# Altium schematic sheet 43-OVER VOLTAGE PROTECTION CKT.SchDoc
size 513 x 386 mm
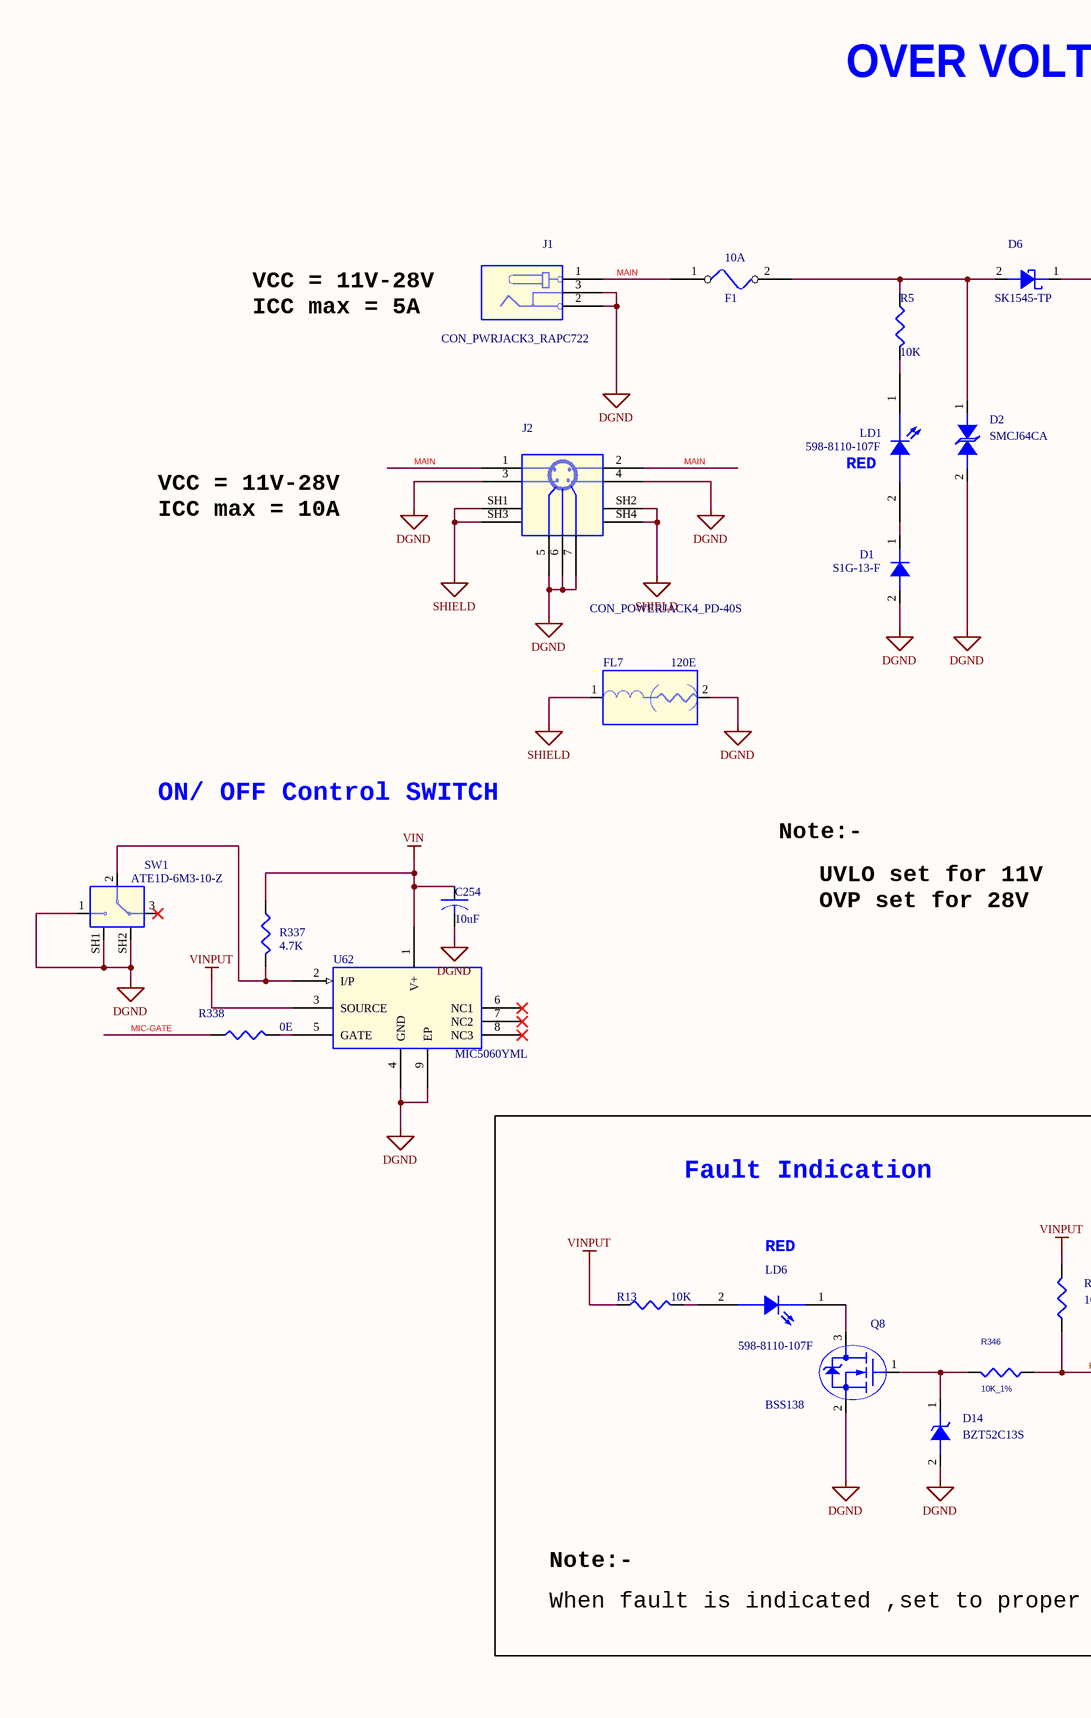
[diagram p0: 43-OVER VOLTAGE PROTECTION CKT.SchDoc, left]
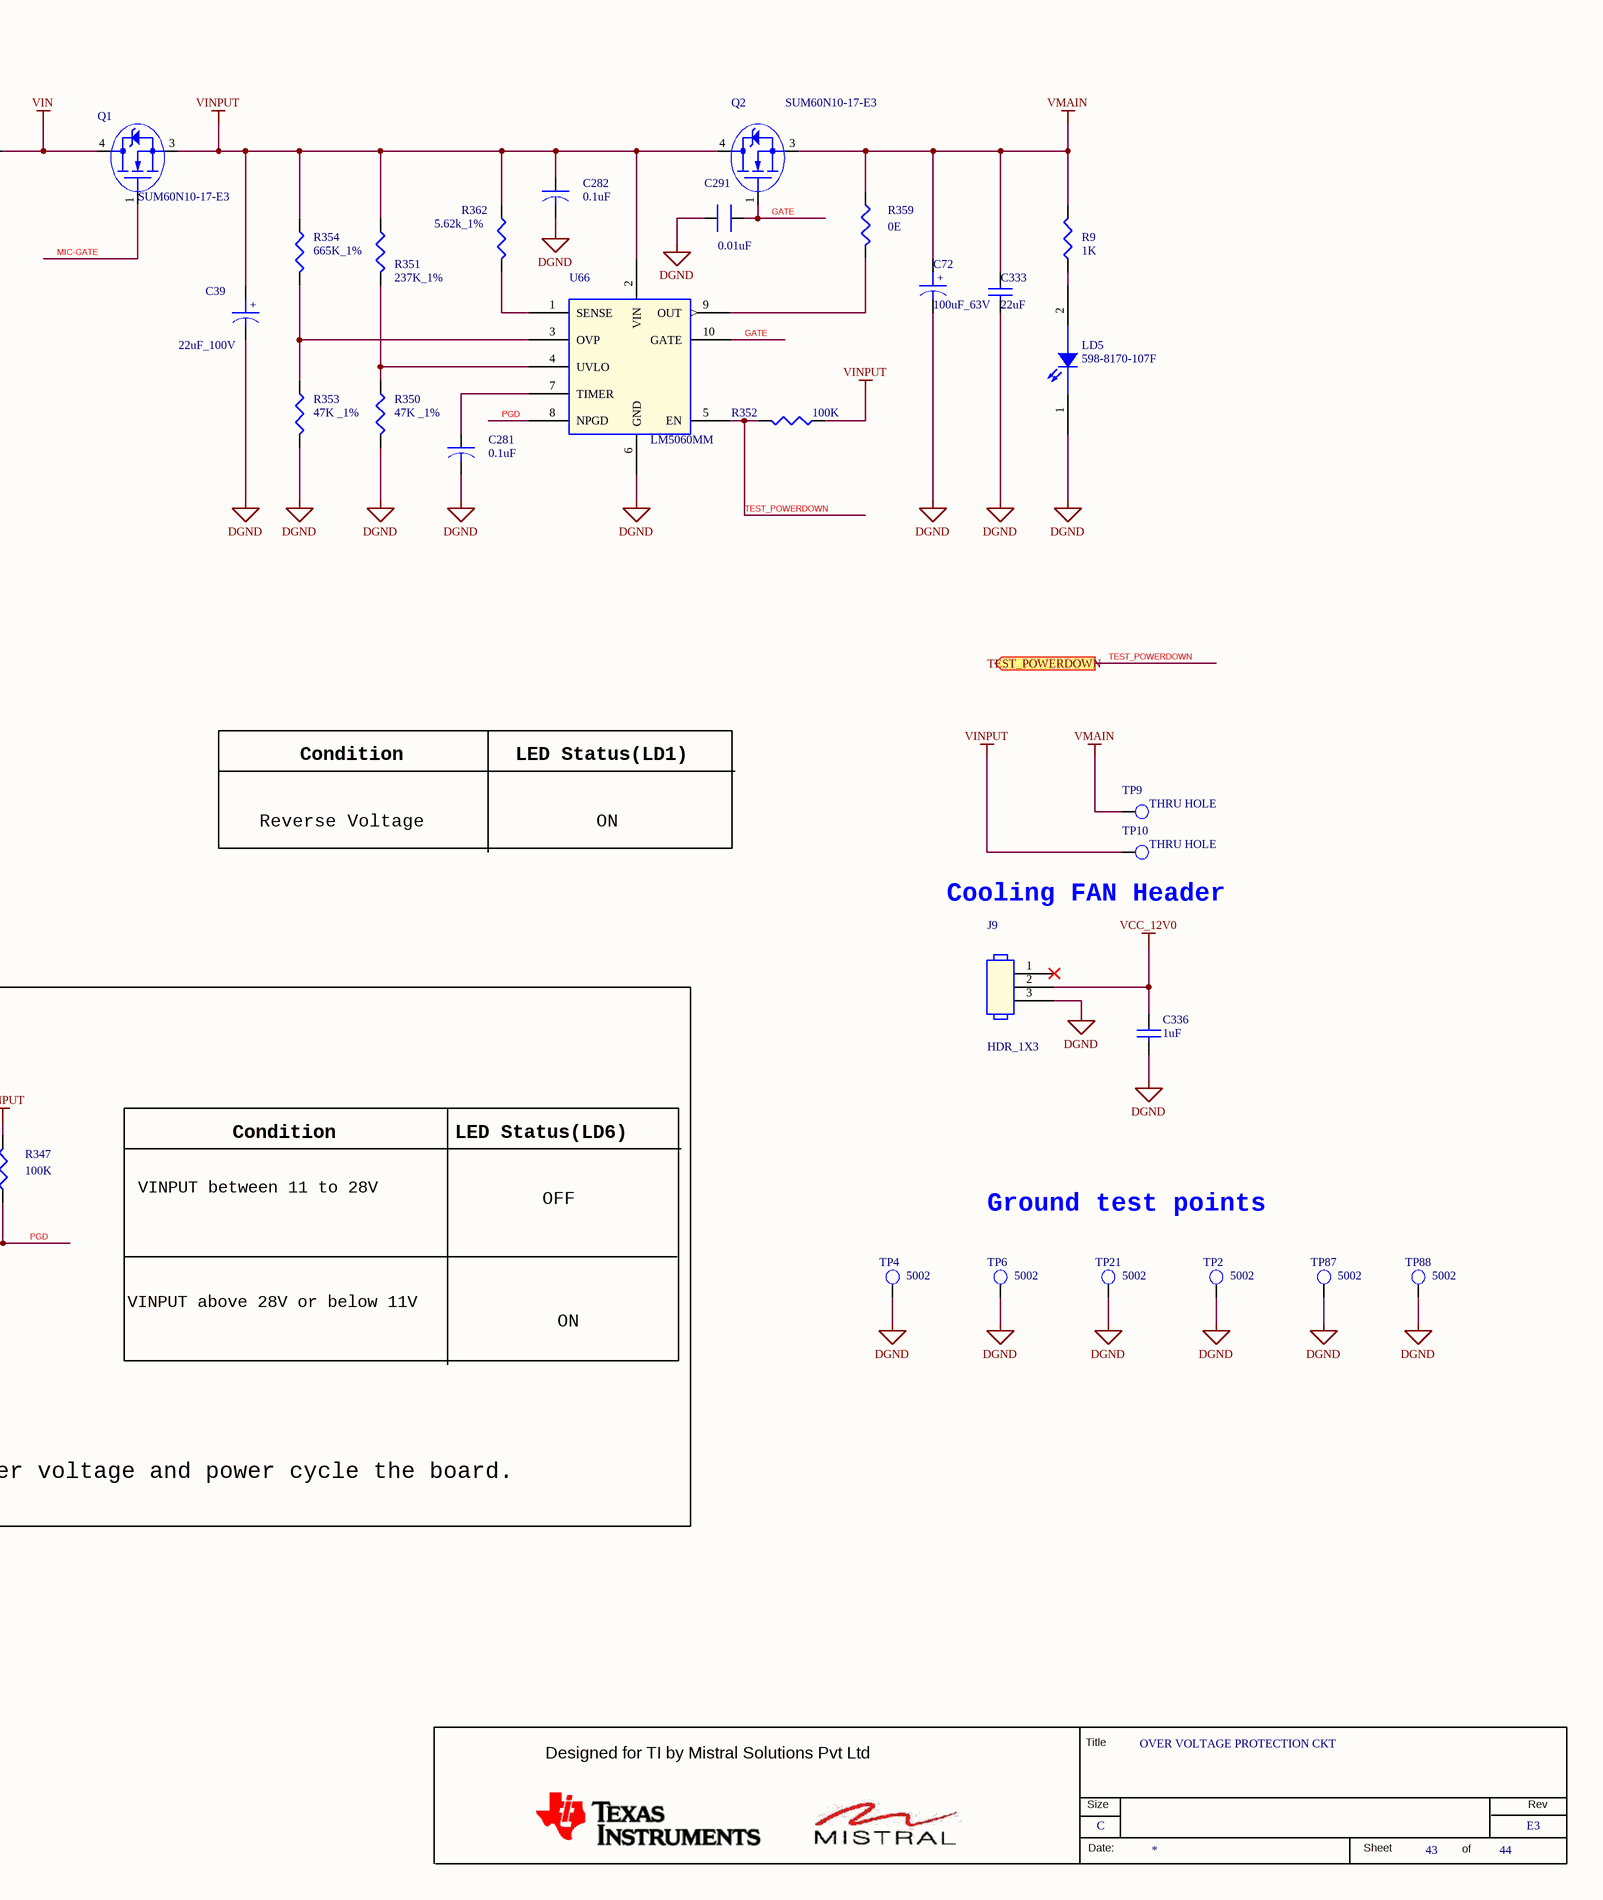
[diagram p1: 43-OVER VOLTAGE PROTECTION CKT.SchDoc, right]

## Parts
*  RevCode: E3  Title: OVER VOLTAGE PROTECTION CKT  Page Size: C  Page Number: 43  Page Count: 44  (hidden comment: MISTRAL_TITLEBLK_CSIZE)  (graphical)
C39  22uF_100V  [CAPAE_GCASE]
C72  100uF_63V  [CAPAE_CASE103103_11]
C254  10uF  [CAP1206_2]
C281  0.1uF  [CAP0603_1]
C282  0.1uF  [CAP0603_1]
C291  0.01uF  [CAP0201_0-5]
C333  22uF  [CAP7563_4]
C336  1uF  [CAP0603_1]
D1  S1G-13-F  [DIO_SMA]
D2  SMCJ64CA  [DIO_SMC]
D6  SK1545-TP  [DO-214AB_5-6]
D14  BZT52C13S  [DIO_SOD323]
F1  10A  [FUSE_397_410X110_SMD_2-9]
FL7  120E  [EMIFIL_BLM15A_0402_0-6]
J1  CON_PWRJACK3_RAPC722  [CON_PWRJACK3_RAPC722_P_R_T]
J2  CON_POWERJACK4_PD-40S  [CON_POWERJACK4_PD-40S_S_R_T_15]
J9  HDR_1X3  [HDR_1X3_440054-3_S_T_6-4]
LD1  598-8110-107F  [LED_0805]
LD5  598-8170-107F  [LED_0805_0-7]
LD6  598-8110-107F  [LED_0805]
Q1  SUM60N10-17-E3  [D2PAK-3]
Q2  SUM60N10-17-E3  [D2PAK-3]
Q8  BSS138  [TO_SOT23-123]
R5  10K  [RES1206]
R9  1K  [RES0201]
R13  10K  [RES1206]
R337  4.7K  [RES0402]
R338  0E  [RES0402_0-5]
R346  10K_1%  [RES0402_0-5]
R347  100K  [RES0402_0-5]
R350  47K _1%  [RES0402_0-5]
R351  237K_1%  [RES0402]
R352  100K  [RES0402_0-5]
R353  47K _1%  [RES0402_0-5]
R354  665K_1%  [RES0603_0-5]
R359  0E  [RES0402_0-5]
R362  5.62k_1%  [RES0603]
SW1  ATE1D-6M3-10-Z  [SW3_ATE1F-6M3_370X710_TH_5-6]
TP2  5002  [TP_CIR67D40_TH_4-6]
TP4  5002  [TP_CIR67D40_TH_4-6]
TP6  5002  [TP_CIR67D40_TH_4-6]
TP9  THRU HOLE  [TP_40X65]
TP10  THRU HOLE  [TP_40X65]
TP21  5002  [TP_CIR67D40_TH_4-6]
TP87  5002  [TP_CIR67D40_TH_4-6]
TP88  5002  [TP_CIR67D40_TH_4-6]
U62  MIC5060YML  [DFN8_25-59_120X120_1]
U66  LM5060MM  [MSOP10_19-68_120X120]

## Blocks framed on the sheet
Fault Indication: D14 LD6 Q8 R13 R346 R347

## Ports
TEST_POWERDOWN (out)

## Nets
DGND: C39.2 C72.2 C254.2 C281.2 C282.2 C291.2 C333.2 C336.2 D1.2(A) D2.2(ANODE) D14.2(ANODE) FL7.2 J1.2 J1.3 J2.3 J2.4 J2.5 J2.6 J2.7 J9.3 LD5.1 Q8.2(S) R350.2 R353.2 SW1.1 SW1.SH1 SW1.SH2 TP2.1(TP) TP4.1(TP) TP6.1(TP) TP21.1(TP) TP87.1(TP) TP88.1(TP) U62.4(GND) U62.9(EP) U66.6(GND)
SHIELD: FL7.1 J2.SH1 J2.SH2 J2.SH3 J2.SH4
VCC_12V0: C336.1 J9.2
VIN: C254.1 D6.1(CATHODE) Q1.4(D) R337.1 U62.1(V+)
VINPUT: C39.1 C282.1 Q1.3(S) Q2.4(D) R13.1 R347.2 R351.1 R352.1 R354.1 R362.1 TP10.1(TP) U62.3(SOURCE) U66.2(VIN)
VMAIN: C72.1 C333.1 Q2.3(S) R9.1 R359.1 TP9.1(TP)
GATE: C291.1 Q2.1(G) U66.10(GATE)
MAIN: F1.1 J1.1 J2.1 J2.2
MIC-GATE: Q1.1(G) R338.1
PGD: R346.1 R347.1 U66.8(NPGD)
TEST_POWERDOWN: R352.2 U66.5(EN) ; port TEST_POWERDOWN
NetC281_1: C281.1 U66.7(TIMER)
NetD1_1: D1.1(K) LD1.2
NetD2_1: D2.1(CATHODE) D6.2(ANODE) F1.2 R5.1
NetD14_1: D14.1(CATHODE) Q8.1(G) R346.2
NetLD1_1: LD1.1 R5.2
NetLD5_2: LD5.2 R9.2
NetLD6_1: LD6.1 Q8.3(D)
NetLD6_2: LD6.2 R13.2
NetR337_2: R337.2 SW1.2 U62.2(I/P)
NetR338_2: R338.2 U62.5(GATE)
NetR350_1: R350.1 R351.2 U66.4(UVLO)
NetR353_1: R353.1 R354.2 U66.3(OVP)
NetR359_2: R359.2 U66.9(OUT)
NetR362_2: R362.2 U66.1(SENSE)

Not connected (* = marked no-connect by the designer): J9 1*; SW1 3*; U62 6(NC1)* 7(NC2)* 8(NC3)*

## Notes on the sheet
- OVER VOLTAGE PROTECTION CIRCUIT
- VCC = 11V-28V
  ICC max = 5A
- (near LD1) RED
- VCC = 11V-28V
  ICC max = 10A
- ON/ OFF Control SWITCH
- Note:-
- UVLO set for 11V
  OVP set for 28V
- Reverse Voltage
- Condition
- LED Status(LD1)
- ON
- (near TP10) Cooling FAN Header
- (near LD6) RED
- LED Status(LD6)
- VINPUT between 11 to 28V
- OFF
- Ground test points
- VINPUT above 28V or below 11V
- When fault is indicated ,set to proper voltage and power cycle the board.
- (in symbol CAP_POL) +
- (in symbol MISTRAL_TITLEBLK_CSIZE) Title; Designed for TI by Mistral Solutions Pvt Ltd; Size; Rev; Date:; Sheet; of

## Library data of the parts
* = MISTRAL_TITLEBLK_CSIZE: Issue: 1.0; Page Create Date: March  8, 1995; Page Modify Date: *
C39 = CAP_POL: CAP ELECTROLYTIC 22uF 100V 20% GCASE_103103; Part_type: CAPACITORS\ELECTROLYTIC; Mfr_part_number: EEE-HA2A220P; Mfr_name: PANASONIC-ECG; Mistral Part No: 120011120008-R; Custom_Duty: 15%; Customs_HS_Code: 85322990; Wattage: NA; Project: NA10NG; Library Ref: CAP_POL; Chkd/date: USMAN/141211; Crtd /date: CHAITHANYA/131211; Datasheet: Y:\MIS_DATABASE\DATASHEETS\CAPACITORS\EEEHA-V-SERIES.PDF; Temperature: -40°C+105°C; Weight: NA; Height: 10.50MM; Distributor_part_number: PCE4250CT-ND; Distributor_name: DIGIKEY; Package: GCASE_103103; Voltage: 100V; Tolerance: 20%; PCB Footprint: CAPAE_GCASE
C72 = CAP_POL: CAP ELECTROLYTIC 100uF 63V 20% CASE_103103; Mistral Part No: 120018010018-R; Mfr_name: NICHICON; Mfr_part_number: UUX1J101MNL1GS; Part_type: CAPACITORS\ELECTROLYTIC; Project: TI_MAXIE_CPB; Wattage: NA; Customs_HS_Code: 85322990; Custom_Duty: 15%; Library Ref: CAP_POL; PCB Footprint: CAPAE_CASE103103_11; Tolerance: 20%; Voltage: 63V; Package: CASE_103103; Distributor_name: DIGIKEY; Distributor_part_number: 493-7453-1-ND; Height: 10.80MM; Weight: 1.21g; Temperature: -55°C+105°C; Datasheet: Y:\MIS_DATABASE\DATASHEETS\CAPACITORS\UUX-SER.PDF; Crtd /date: MANIRAJA/120218; Chkd/date: MANIRAJA/120218; MECHANICAL 3D STEP FILE: CAPAE_CASE103103_11
C254 = CAP: CAP CERAMIC 10uF 50V 20% X5R 1206; Part_type: CAPACITORS\CERAMIC; Mfr_part_number: GRM31CR61H106MA12L; Mfr_name: MURATA; Mistral Part No: 120018010013-R; Custom_Duty: 15%; Customs_HS_Code: 85322990; Wattage: NA; Project: TI_MAXIE_CPB; Footprint Ref: CAP1206_2; Library Ref: CAP; Chkd/date: MANIRAJA/240118; Crtd /date: MANIRAJA/240118; Datasheet: Y:\MIS_DATABASE\DATASHEETS\CAPACITORS\GRM31CR61H106MA12.PDF; Temperature: -55°C+85°C; Weight: 40mg; Height: 1.80MM; Distributor_part_number: 490-10756-1-ND; Distributor_name: DIGIKEY; Package: 1206; Voltage: 50V; Tolerance: 20%; PCB Footprint: CAP1206_2; MECHANICAL 3D STEP FILE: CAP1206_2; Library Path: Y:\MIS_DATABASE\Library\ALTIUM_TOOL\SCHEMATICS_PARTS\MS_DISCRETE_Library.schlib; Footprint Path: Y:\MIS_DATABASE\Library\ALTIUM_TOOL\PCB_FOOTPRINTS\Altium_Footprint_Lib.PcbLib
C281 C282 = CAP_Dup1: CAP CERAMIC 0.1uF 50V 20% X7R 0603; Mistral Part No: 120018010021-R; Mfr_name: KEMET; Mfr_part_number: C0603C104M5RACTU; Part_type: CAPACITORS\CERAMIC; Project: TI_MAXIE_CPB; Wattage: NA; Customs_HS_Code: 85322990; Custom_Duty: 15%; Library Ref: CAP; MECHANICAL 3D STEP FILE: CAP0603_1; Tolerance: 20%; Voltage: 50V; Package: 0603; Distributor_name: DIGIKEY; Distributor_part_number: 399-7845-1-ND; Height: 0.95MM; Weight: 2mg; Temperature: -55°C+125°C; Datasheet: Y:\MIS_DATABASE\DATASHEETS\CAPACITORS\KEMET-X7R-SER.PDF; Crtd /date: MANIRAJA/240118; Chkd/date: MANIRAJA/240118; PCB Footprint: CAP0603_1
C291 = CAP_Dup3: CAP CERAMIC 0.01uF 25V 10% X5R 0201; Mistral Part No: 120018010007-R; Mfr_name: MURATA; Mfr_part_number: GRM033R61E103KA12J; Part_type: CAPACITORS\CERAMIC; Wattage: NA; Project: TI_MAXIE_CPB; Customs_HS_Code: 85322990; Custom_Duty: 15%; NI_MARK: DNI; Library Ref: CAP; MECHANICAL 3D STEP FILE: CAP0201_0-5; Temperature: -55°C+85°C; Weight: 0.33mg; Tolerance: 10%; Voltage: 25V; Package: 0201; Distributor_name: DIGIKEY; Distributor_part_number: GRM033R61E103KA12J-ND; Height: 0.33MM; Datasheet: Y:\MIS_DATABASE\DATASHEETS\CAPACITORS\GRM033R61E103KA12.PDF; Crtd /date: MANIRAJA/230118; Chkd/date: MANIRAJA/230118; PCB Footprint: CAP0201_0-5
C333 = CAP_Dup5: CAP CERAMIC 22uF 50V 20% X7R 7563; Part_type: CAPACITORS\CERAMIC; Mfr_part_number: KTS500B226M76N0T00; Mfr_name: NIPPON CHEMICON; Mistral Part No: 120017100007-R; Custom_Duty: 15%; Customs_HS_Code: 85322990; Wattage: NA; Project: TI_MAXIE_CPB; Library Ref: CAP; MECHANICAL 3D STEP FILE: CAP7563_4; Chkd/date: MANIRAJA/121017; Crtd /date: MANIRAJA/121017; Datasheet: Y:\MIS_DATABASE\DATASHEETS\CAPACITORS\NTS-NTF-SER.PDF; Temperature: -55°C+125°C; Weight: NA; Height: 4.00MM; Distributor_part_number: 565-4700-1-ND; Distributor_name: DIGIKEY; Package: 7563; Voltage: 50V; Tolerance: 20%; PCB Footprint: CAP7563_4
C336 = CAP_Dup5: CAP CERAMIC 1uF 25V 10% X5R 0603; Mistral Part No: 120010080040-R; Mfr_name: AVX CORPORATION; Mfr_part_number: 06033D105KAT2A; Part_type: CAPACITORS\CERAMIC; Project: TI_MAXIE_CPB; Wattage: NA; Customs_HS_Code: 85322990; Custom_Duty: 15%; Library Ref: CAP; Tolerance: 10%; Voltage: 25V; Package: 0603; Distributor_name: DIGIKEY; Distributor_part_number: 478-5142-1-ND; Height: 0.94MM; Weight: 2mg; Temperature: -55°C+85°C; Datasheet: Y:\MIS_DATABASE\DATASHEETS\CAPACITORS\AVX_MLC.PDF; Crtd /date: MANIRAJA/230118; Chkd/date: MANIRAJA/230118; PCB Footprint: CAP0603_1; MECHANICAL 3D STEP FILE: CAP0603_1
D1 = DIODE: DIODE RECTIFIER 400V 1A SMA; Mistral Part No: 130009030153; Mfr_name: DIODES INC; Part_type: DIODE\RECTIFIER; Project: CPB; Customs_HS_Code: 85412900; Custom_Duty: 15%; Library Ref: DIODE; Mfr_part_number: S1G-13-F; Voltage: 400V; Package: SMA; Distributor_name: DIGIKEY; Distributor_part_number: S1G-FDICT-ND; Height: 2.30MM; Weight: 0.0064g; Temperature: -65°C+150°C; Datasheet: Y:\MIS_DATABASE\DATASHEETS\DISCRETES\DIODES\S1.PDF; Crtd /date: USMAN/220808; Chkd/date: SUHAS/061010; PCB Footprint: DIO_SMA
D2 = DIODE_TVS_DUAL: DIODE TVS BI-DIE 1500W 64V SMC; Mistral Part No: 130015100009-R; Mfr_name: LITTLE FUSE; Part_type: DIODE\TVS; Project: GALILEO_EVM; Tolerance: NA; Customs_HS_Code: 85412900; Custom_Duty: 15%; Library Ref: DIODE_TVS_DUAL; Mfr_part_number: SMCJ64CA; Voltage: 64V; Wattage: NA; Package: SMC; Distributor_name: DIGIKEY; Distributor_part_number: SMCJ64CALFCT-ND; Height: 2.62MM; Weight: NA; Temperature: -55°C+150°C; Datasheet: Y:\MIS_DATABASE\DATASHEETS\DISCRETES\DIODES\LTFUSE-SMCJ.PDF; Crtd /date: VASANTHA/101015; Chkd/date: VASANTHA/101015; PCB Footprint: DIO_SMC
D6 = DIODE_SCHOTTKY: DIODE SCHOTTKY RECTIFIER 45V 15A DO-214AB; Mistral Part No: 130017100014-R; Mfr_name: MCC; Part_type: DIODE\SCHOTTKY; Project: TI_MAXIE_CPB; Tolerance: NA; Customs_HS_Code: 85412900; Custom_Duty: 15%; Library Ref: DIODE_SCHOTTKY; Mfr_part_number: SK1545-TP; Voltage: NA; Wattage: NA; Package: DO-214AB; Distributor_name: DIGIKEY; Distributor_part_number: SK1545-TPCT-ND; Height: 5.56MM; Weight: 34mg; Temperature: -55°C+125°C; Datasheet: Y:\MIS_DATABASE\DATASHEETS\DISCRETES\DIODES\SK15XX.PDF; Crtd /date: MANIRAJA/121017; Chkd/date: MANIRAJA/121017; MECHANICAL 3D STEP FILE: DO-214AB_5-6; PCB Footprint: DO-214AB_5-6
D14 = DIODE_ZENER: DIODE ZENER 13V 200mW SOD323; Mistral Part No: 130010120013-R; Mfr_name: DIODES INC; Mfr_part_number: BZT52C13S-7-F; Part_type: DIODE\ZENER; Project: IEMS; Tolerance: NA; Customs_HS_Code: 85412900; Custom_Duty: 15%; Library Ref: DIODE_ZENER; Voltage: NA; Wattage: 200mW; Package: SOD323; Distributor_name: DIGIKEY; Distributor_part_number: BZT52C13S-FDICT-ND; Height: 1.05MM; Weight: 0.004g; Temperature: -65°C+150°C; Datasheet: Y:\MIS_DATABASE\DATASHEETS\DISCRETES\DIODES\BZT52C.PDF; Crtd /date: BAVISH/101210; Chkd/date: MAZHAR/101210; PCB Footprint: DIO_SOD323
F1 = FUSE: FUSE 10A 60V FAST SMD; Mistral Part No: 130009030821-R; Mfr_name: COOPER BUSSMANN; Mfr_part_number: 1025FA10-R; Part_type: MISC\FUSE; Project: SMART VIEW_NVR; Library Ref: FUSE; Voltage: 60V; Package: SMD; Distributor_name: DIGIKEY; Distributor_part_number: TR2/1025FA10-R-ND; Height: 2.90MM; Datasheet: Y:\MIS_DATABASE\DATASHEETS\MISC\FUSE\1025FA-SER.PDF; Crtd /date: MAZHAR/220907; Chkd/date: RAGESH/151010; PCB Footprint: FUSE_397_410X110_SMD_2-9
FL7 = EMIFILTER_IND: FERRITE CHIP 120E 1.3A 0402; Mistral Part No: 130012030043-R; Mfr_name: MURATA; Mfr_part_number: BLM15PD121SN1; Part_type: MISC\FILTER; Project: GEN_3-8; Tolerance: 25%; Voltage: NA; Customs_HS_Code: 85437099; Custom_Duty: 24%; Footprint Path: Y:\MIS_DATABASE\Library\ALTIUM_TOOL\PCB_FOOTPRINTS\Altium_Footprint_Lib.PcbLib; Library Path: Y:\MIS_DATABASE\Library\ALTIUM_TOOL\SCHEMATICS_PARTS\MS_FILTER_Library.schlib; Footprint Ref: EMIFIL_BLM15A_0402_0-6; Library Ref: EMIFILTER_IND; Wattage: NA; Package: 0402; Distributor_name: DIGIKEY; Distributor_part_number: 490-5203-1-ND; Height: 0.55MM; Weight: 0.65mg; Temperature: -55°C+125°C; Datasheet: Y:\MIS_DATABASE\DATASHEETS\DISCRETES\INDUCTORS\BLM18K-SERIES.PDF; Crtd /date: CHAITHANYA/150312; Chkd/date: VASANTHA/010117; MECHANICAL 3D STEP FILE: EMIFIL_BLM15A_0402_0-6; PCB Footprint: EMIFIL_BLM15A_0402_0-6
J1 = CON_PWRJACK3_RAPC722: CON POWER JACK 3POS 5A 1.93MMPIN-DIA MALE RT TH; Part_type: CONNECTOR\JACK; Mfr_part_number: RAPC722X; Mfr_name: SWITCHCRAFT; Mistral Part No: 150011020010-R; Custom_Duty: 24%; Customs_HS_Code: 85369090; Wattage: NA; Project: KENNEL; Library Ref: CON_PWRJACK3_RAPC722; Chkd/date: MAZHAR/220311; Crtd /date: BAVISH/230211; Datasheet: Y:\MIS_DATABASE\DATASHEETS\CONNECTORS\RAPC722.PDF; Temperature: NA; Weight: SOIC8; Height: 11.00MM; Distributor_part_number: SC1313-ND; Distributor_name: DIGIKEY; Package: THRU-HOLE; Voltage: NA; Tolerance: NA; PCB Footprint: CON_PWRJACK3_RAPC722_P_R_T
J2 = CON_POWERJACK_PD-40S: CON POWER JACK 4POS FEMALE RT TH; Mistral Part No: 150016060015-R; Mfr_name: CUI INC; Mfr_part_number: PD-40S; Part_type: CONNECTOR\JACK; Project: NTR_GPSDO BOX CARD; Tolerance: NA; Customs_HS_Code: 85369090; Custom_Duty: 24%; Library Ref: CON_POWERJACK_PD-40S; Voltage: NA; Wattage: NA; Package: THRU-HOLE; Distributor_name: DIGIKEY; Distributor_part_number: CP-7240-ND; Height: 15.00MM; Weight: NA; Temperature: NA; Datasheet: Y:\MIS_DATABASE\DATASHEETS\CONNECTORS\PD-40S.PDF; Crtd /date: VASANTHA/140616; Chkd/date: VASANTHA/140616; MECHANICAL 3D STEP FILE: CON_POWERJACK4_PD-40S_S_R_T_15; PCB Footprint: CON_POWERJACK4_PD-40S_S_R_T_15
J9 = HEADER_3X1: CON HDR 1X3 2.00MM PITCH ST TH; Part_type: CONNECTOR\HEADERS; Mfr_part_number: 440054-3; Mfr_name: TE CONNECTIVITY; Mistral Part No: 150017100038-R; Custom_Duty: 24%; Customs_HS_Code: 85369090; Wattage: NA; Project: TI_MAXIE_CPB; Library Ref: HEADER_3X1; PCB Footprint: HDR_1X3_440054-3_S_T_6-4; MECHANICAL 3D STEP FILE: HDR_1X3_440054-3_S_T_6-4; Chkd/date: MANIRAJA/261017; Crtd /date: MANIRAJA/261017; Datasheet: Y:\MIS_DATABASE\DATASHEETS\CONNECTORS\440054XXX.PDF; Temperature: -25°C+85°C; Weight: NA; Height: 6.35MM; Distributor_part_number: A100035-ND; Distributor_name: DIGIKEY; Package: THRU-HOLE; Voltage: NA; Tolerance: NA
LD1 = LED_598-8170-107F: LED ALINGAP RED CLEAR 0805 SMD; Part_type: OPTO\LED; Mfr_name: DIALIGHT; Mistral Part No: 130014050069-R; Custom_Duty: 24%; Customs_HS_Code: 85437099; Wattage: NA; Project: AEGIS GP BETA2; Library Ref: LED_598-8170-107F; Chkd/date: BALACHANDAR/160514; Crtd /date: SARANYA/070514; Datasheet: Y:\MIS_DATABASE\DATASHEETS\DISCRETES\LEDS\598-SER.PDF; Temperature: NA; Weight: NA; Height: 0.70MM; Distributor_part_number: 350-2038-1-ND; Distributor_name: DIGIKEY; Package: 0805; Voltage: NA; Tolerance: NA; Mfr_part_number: 598-8110-107F; PCB Footprint: LED_0805
LD5 = LED_598-8170-107F: LED ALINGAP GREEN CLEAR 0805; Mistral Part No: 130014050065-R; Mfr_name: DIALIGHT; Part_type: OPTO\LED; Project: AEGIS GP BETA2; Tolerance: NA; Customs_HS_Code: 85437099; Custom_Duty: 24%; Library Ref: LED_598-8170-107F; Mfr_part_number: 598-8170-107F; Voltage: NA; Wattage: NA; Package: 0805; Distributor_name: DIGIKEY; Distributor_part_number: 350-2044-1-ND; Height: 0.70MM; Weight: NA; Temperature: -30°C+85°C; Datasheet: Y:\MIS_DATABASE\DATASHEETS\DISCRETES\LEDS\598-SER.PDF; Crtd /date: SARANYA/070514; Chkd/date: MANIRAJA/230817; MECHANICAL 3D STEP FILE: LED_0805_0-7; PCB Footprint: LED_0805_0-7
LD6 = LED_598-8170-107F: LED ALINGAP RED CLEAR 0805 SMD; Mistral Part No: 130014050069-R; Mfr_name: DIALIGHT; Part_type: OPTO\LED; Project: AEGIS GP BETA2; Tolerance: NA; Customs_HS_Code: 85437099; Custom_Duty: 24%; Library Ref: LED_598-8170-107F; Mfr_part_number: 598-8110-107F; Voltage: NA; Wattage: NA; Package: 0805; Distributor_name: DIGIKEY; Distributor_part_number: 350-2038-1-ND; Height: 0.70MM; Weight: NA; Temperature: NA; Datasheet: Y:\MIS_DATABASE\DATASHEETS\DISCRETES\LEDS\598-SER.PDF; Crtd /date: SARANYA/070514; Chkd/date: BALACHANDAR/160514; PCB Footprint: LED_0805
Q1 = MOSFET_IRFZ24NS: IC POWER MOSFET N-CHANNEL D2PAK; Part_type: ICS\POWER\MOSFET; Mfr_name: VISHAY; Mistral Part No: 142015100008-R; Custom_Duty: 15%; Customs_HS_Code: 85423100; Wattage: NA; Voltage: 100V; Project: GALILEO_EVM; Library Ref: MOSFET_IRFZ24NS; Chkd/date: VASANTHA/101015; Crtd /date: VASANTHA/101015; Datasheet: Y:\MIS_DATABASE\DATASHEETS\DISCRETES\TRANSISTORS_FETS\SUM60N10.PDF; Temperature: -55°C+175°C; Weight: NA; Height: 4.82MM; Distributor_part_number: SUM60N10-17-E3CT-ND; Distributor_name: DIGIKEY; Package: D2PAK; Tolerance: NA; Mfr_part_number: SUM60N10-17-E3; PCB Footprint: D2PAK-3
Q2 = MOSFET_IRFZ24NS: IC POWER MOSFET N-CHANNEL D2PAK; Mistral Part No: 142015100008-R; Mfr_name: VISHAY; Part_type: ICS\POWER\MOSFET; Project: GALILEO_EVM; Tolerance: NA; Voltage: 100V; Customs_HS_Code: 85423100; Custom_Duty: 15%; Library Ref: MOSFET_IRFZ24NS; Mfr_part_number: SUM60N10-17-E3; Wattage: NA; Package: D2PAK; Distributor_name: DIGIKEY; Distributor_part_number: SUM60N10-17-E3CT-ND; Height: 4.82MM; Weight: NA; Temperature: -55°C+175°C; Datasheet: Y:\MIS_DATABASE\DATASHEETS\DISCRETES\TRANSISTORS_FETS\SUM60N10.PDF; Crtd /date: VASANTHA/101015; Chkd/date: VASANTHA/101015; PCB Footprint: D2PAK-3
Q8 = MOSFET_BSS138: IC MOSFET N-CHANNEL 50V 200mA SOT23-3; Part_type: ICS\POWER\MOSFET; Mfr_part_number: BSS138-7-F; Mfr_name: DIODES INC; Mistral Part No: 142009070019-R; Custom_Duty: 15%; Customs_HS_Code: 85423100; Wattage: 300mW; Project: KHAN_MAIN; Library Ref: MOSFET_BSS138; Chkd/date: SUHAS/191010; Crtd /date: USMAN/240709; Datasheet: Y:\MIS_DATABASE\DATASHEETS\DISCRETES\TRANSISTORS_FETS\BSS138.PDF; Temperature: -55°C+150°C; Weight: 0.008g; Height: 1.20MM; Distributor_part_number: BSS138CT-ND; Distributor_name: DIGIKEY; Package: SOT23-3; Voltage: 50V; PCB Footprint: TO_SOT23-123
R5 = RESISTOR: RES 10K 2/3W 5% 1206; Part_type: RESISTORS\FIXED; Mfr_part_number: ERJ-P08J103V; Mfr_name: PANASONIC; Mistral Part No: 110015090016-R; Custom_Duty: 15%; Customs_HS_Code: 85332119; Voltage: NA; Project: GALILEO_EVM; Library Ref: RESISTOR; PCB Footprint: RES1206; Chkd/date: VASANTHA/101015; Crtd /date: VASANTHA/101015; Datasheet: Y:\MIS_DATABASE\DATASHEETS\RESISTORS\ERJ_SERIES.PDF; Temperature: -55°C+155°C; Weight: 10g/1000pcs; Height: 0.70MM; Distributor_part_number: P10KALCT-ND; Distributor_name: DIGIKEY; Package: 1206; Wattage: 2/3W; Tolerance: 5%
R9 = RESISTOR_Dup1: RES 1K 1/20W 5% 0201; Part_type: RESISTORS\FIXED; Mfr_part_number: CRCW02011K00FKED; Mfr_name: VISHAY; Mistral Part No: 110015080014-R; Custom_Duty: 15%; Customs_HS_Code: 85332119; Project: OCTASIC_3000; Voltage: NA; Library Ref: RESISTOR; Chkd/date: JEBRAN/110815; Crtd /date: JEBRAN/110815; Datasheet: Y:\MIS_DATABASE\DATASHEETS\RESISTORS\CRCW0201.PDF; Height: 0.28MM; Distributor_part_number: 541-1.00KAABCT-ND; Distributor_name: DIGIKEY; Package: 0201; Wattage: 1/20W; Tolerance: 5%; Weight: NA; Temperature: -55°C+155°C; PCB Footprint: RES0201
R13 = RESISTOR: RES 10K 2/3W 5% 1206; Mistral Part No: 110015090016-R; Mfr_name: PANASONIC; Mfr_part_number: ERJ-P08J103V; Part_type: RESISTORS\FIXED; Project: GALILEO_EVM; Voltage: NA; Customs_HS_Code: 85332119; Custom_Duty: 15%; Library Ref: RESISTOR; PCB Footprint: RES1206; Tolerance: 5%; Wattage: 2/3W; Package: 1206; Distributor_name: DIGIKEY; Distributor_part_number: P10KALCT-ND; Height: 0.70MM; Weight: 10g/1000pcs; Temperature: -55°C+155°C; Datasheet: Y:\MIS_DATABASE\DATASHEETS\RESISTORS\ERJ_SERIES.PDF; Crtd /date: VASANTHA/101015; Chkd/date: VASANTHA/101015
R337 = RESISTOR_Dup3: RES 4.7K 1/16W 5% 0402; Part_type: RESISTORS\FIXED; Mfr_part_number: RC0402JR-074K7L; Mfr_name: YAGEO AMERICA; Mistral Part No: 110009030792-R; Custom_Duty: 15%; Customs_HS_Code: 85332119; Voltage: NA; Project: TMDXCSK368; Library Ref: RESISTOR; Chkd/date: VASANTHA/130516; Crtd /date: VASANTHA/130516; Datasheet: Y:\MIS_DATABASE\DATASHEETS\RESISTORS\YAGEO-RC0402.PDF; Temperature: -55°C+155°C; Weight: NA; Height: 0.55MM; Distributor_part_number: 311-4.7KJRCT-ND; Distributor_name: DIGIKEY; Package: 0402; Wattage: 1/16W; Tolerance: 5%; PCB Footprint: RES0402
R338 = RESISTOR_Dup2: RES 0E 1/16W 0402; Mistral Part No: 110010080019-P; Mfr_name: VISHAY; Mfr_part_number: CRCW04020000Z0ED; Part_type: RESISTORS\FIXED; Project: PB_BUGBASE; Tolerance: NA; Customs_HS_Code: 85332119; Custom_Duty: 15%; Footprint Path: Y:\MIS_DATABASE\Library\ALTIUM_TOOL\PCB_FOOTPRINTS\Altium_Footprint_Lib.PcbLib; Library Path: Y:\MIS_DATABASE\Library\ALTIUM_TOOL\SCHEMATICS_PARTS\MS_DISCRETE_Library.schlib; Footprint Ref: RES0402_0-5; Library Ref: RESISTOR; Wattage: 1/16W; Package: 0402; Distributor_name: DIGIKEY; Distributor_part_number: 541-0.0JCT-ND; Height: 0.40MM; Datasheet: Y:\MIS_DATABASE\DATASHEETS\RESISTORS\CRCW0603.PDF; Crtd /date: MUDDU/190810; Chkd/date: VASANTHA/201216; RoHS: Pb-Free; Voltage: NA; Weight: 0.65g/1000pcs; Temperature: -55°C+155°C; MECHANICAL 3D STEP FILE: RES0402_0-5; PCB Footprint: RES0402_0-5
R346 = RESISTOR_Dup2: RES 10K 1/16W 1% 0402; Part_type: RESISTORS\FIXED; Mfr_part_number: RC0402FR-0710KL; Mfr_name: YAGEO AMERICA; Mistral Part No: 110009030220-P; Voltage: NA; Custom_Duty: 15%; Customs_HS_Code: 85332119; Project: VOCERA; Footprint Path: Y:\MIS_DATABASE\Library\ALTIUM_TOOL\PCB_FOOTPRINTS\Altium_Footprint_Lib.PcbLib; Library Path: Y:\MIS_DATABASE\Library\ALTIUM_TOOL\SCHEMATICS_PARTS\MS_DISCRETE_Library.schlib; Footprint Ref: RES0402_0-5; Library Ref: RESISTOR; MECHANICAL 3D STEP FILE: RES0402_0-5; Temperature: -55°C+155°C; Weight: 0.65mg; PCB Footprint: RES0402_0-5; RoHS: Pb-Free; Chkd/date: VASANTHA/201216; Crtd /date: GEETHA/290506; Datasheet: Y:\MIS_DATABASE\DATASHEETS\RESISTORS\YAGEO-RC0402.PDF; Height: 0.40MM; Distributor_part_number: 311-10.0KLRTR-ND; Distributor_name: DIGIKEY; Package: 0402; Wattage: 1/16W; Tolerance: 1%
R347 R352 = RESISTOR_Dup1: RES 100K 1/16W 5% 0402; Part_type: RESISTORS\FIXED; Mfr_part_number: CRCW0402100KJNED; Mfr_name: VISHAY; Mistral Part No: 110011060002-R; Custom_Duty: 15%; Customs_HS_Code: 85332119; Project: AM4515_EVM_LCD; Voltage: NA; Library Ref: RESISTOR; Chkd/date: VASANTHA/061216; Crtd /date: BAVISH/010611; Datasheet: Y:\MIS_DATABASE\DATASHEETS\RESISTORS\CRCW0603.PDF; Height: 0.40MM; Distributor_part_number: 541-100KJCT-ND; Distributor_name: DIGIKEY; Package: 0402; Wattage: 1/16W; Tolerance: 5%; PCB Footprint: RES0402_0-5; Weight: 0.65mg; Temperature: -55°C+155°C; MECHANICAL 3D STEP FILE: RES0402_0-5
R350 = RESISTOR_Dup5: RES 47K 1/16W 1% 0402; Mistral Part No: 110009030884-R; Mfr_name: YAGEO AMERICA; Mfr_part_number: RC0402FR-0747KL; Part_type: RESISTORS\FIXED; Voltage: NA; Project: ADR1B; Customs_HS_Code: 85332119; Custom_Duty: 15%; Library Ref: RESISTOR; MECHANICAL 3D STEP FILE: RES0402_0-5; Temperature: -55°C+155°C; Weight: 0.65mg; Tolerance: 1%; Wattage: 1/16W; Package: 0402; Distributor_name: DIGIKEY; Distributor_part_number: 311-47.0KLRCT-ND; Height: 0.40MM; Datasheet: Y:\MIS_DATABASE\DATASHEETS\RESISTORS\YAGEO-RC0402.PDF; Crtd /date: MAZHAR/141206; Chkd/date: VASANTHA/060117; PCB Footprint: RES0402_0-5
R351 = RESISTOR_Dup5: RES 237K 1/16W 1% 0402; Mistral Part No: 110015080038-R; Mfr_name: STACKPOLE ELECTRONICS; Mfr_part_number: RMCF0402FT237K; Part_type: RESISTORS\FIXED; Project: OCTBTS3600; Voltage: NA; Library Ref: RESISTOR; Tolerance: 1%; Wattage: 1/16W; Package: 0402; Distributor_name: DIGIKEY; Distributor_part_number: RMCF0402FT237KCT-ND; Height: 0.40MM; Weight: NA; Temperature: -55°C+155°C; Datasheet: Y:\MIS_DATABASE\DATASHEETS\RESISTORS\RMCF-SERIES1.PDF; Crtd /date: JEBRAN/250815; Chkd/date: JEBRAN/250815; PCB Footprint: RES0402
R353 = RESISTOR_Dup5: RES 47K 1/16W 1% 0402; Part_type: RESISTORS\FIXED; Mfr_part_number: RC0402FR-0747KL; Mfr_name: YAGEO AMERICA; Mistral Part No: 110009030884-R; Voltage: NA; Custom_Duty: 15%; Customs_HS_Code: 85332119; Project: ADR1B; Library Ref: RESISTOR; MECHANICAL 3D STEP FILE: RES0402_0-5; Temperature: -55°C+155°C; Weight: 0.65mg; Chkd/date: VASANTHA/060117; Crtd /date: MAZHAR/141206; Datasheet: Y:\MIS_DATABASE\DATASHEETS\RESISTORS\YAGEO-RC0402.PDF; Height: 0.40MM; Distributor_part_number: 311-47.0KLRCT-ND; Distributor_name: DIGIKEY; Package: 0402; Wattage: 1/16W; Tolerance: 1%; PCB Footprint: RES0402_0-5
R354 = RESISTOR_Dup5: RES 665K 1/10W 1% 0603; Mistral Part No: 110017060002-R; Mfr_name: VISHAY; Mfr_part_number: CRCW0603665KFKEA; Part_type: RESISTORS\FIXED; Project: TI_SVB_CONTROLLER CARD; Voltage: NA; Customs_HS_Code: 85332119; Custom_Duty: 15%; Library Ref: RESISTOR; Tolerance: 1%; Wattage: 1/10W; Package: 0603; Distributor_name: DIGIKEY; Distributor_part_number: 541-665KHCT-ND; Height: 0.50MM; Weight: 2mg; Temperature: -55°C+155°C; Datasheet: Y:\MIS_DATABASE\DATASHEETS\RESISTORS\CRCW0603.PDF; Crtd /date: MANIRAJA/280617; Chkd/date: MANIRAJA/280617; MECHANICAL 3D STEP FILE: RES0603_0-5; PCB Footprint: RES0603_0-5
R359 = RESISTOR_Dup2: RES 0E 1/16W 0402; Part_type: RESISTORS\FIXED; Mfr_part_number: CRCW04020000Z0ED; Mfr_name: VISHAY; Mistral Part No: 110010080019-P; Voltage: NA; Custom_Duty: 15%; Customs_HS_Code: 85332119; Project: PB_BUGBASE; Footprint Path: Y:\MIS_DATABASE\Library\ALTIUM_TOOL\PCB_FOOTPRINTS\Altium_Footprint_Lib.PcbLib; Library Path: Y:\MIS_DATABASE\Library\ALTIUM_TOOL\SCHEMATICS_PARTS\MS_DISCRETE_Library.schlib; Footprint Ref: RES0402_0-5; Library Ref: RESISTOR; MECHANICAL 3D STEP FILE: RES0402_0-5; Temperature: -55°C+155°C; Weight: 0.65g/1000pcs; RoHS: Pb-Free; Chkd/date: VASANTHA/201216; Crtd /date: MUDDU/190810; Datasheet: Y:\MIS_DATABASE\DATASHEETS\RESISTORS\CRCW0603.PDF; Height: 0.40MM; Distributor_part_number: 541-0.0JCT-ND; Distributor_name: DIGIKEY; Package: 0402; Wattage: 1/16W; Tolerance: NA; PCB Footprint: RES0402_0-5
R362 = RESISTOR_Dup5: RES 5.62K 1/10W 1% 0603; Part_type: RESISTORS\FIXED; Mfr_part_number: CRCW06035K62FKEA; Mfr_name: VISHAY; Mistral Part No: 110013110005-R; Custom_Duty: 15%; Customs_HS_Code: 85332119; Voltage: NA; Project: NPOL_FEP; Library Ref: RESISTOR; Chkd/date: USMAN/141113; Crtd /date: USMAN/141113; Datasheet: Y:\MIS_DATABASE\DATASHEETS\RESISTORS\CRCW0603.PDF; Temperature: -55°C+155°C; Weight: NA; Height: 0.50MM; Distributor_part_number: 541-5.62KHCT-ND; Distributor_name: DIGIKEY; Package: 0603; Wattage: 1/10W; Tolerance: 1%; PCB Footprint: RES0603
SW1 = SW3_B12JV: SWITCH TOGGLE SPDT RT TH; Mistral Part No: 130017120017-R; Mfr_name: NIDEC COPAL; Part_type: ELECTRO-MECHANICAL\SWITCH; Project: TI_MAXIE_CPB; Tolerance: NA; Customs_HS_Code: 85369090; Custom_Duty: 24%; Library Ref: SW3_B12JV; PCB Footprint: SW3_ATE1F-6M3_370X710_TH_5-6; Mfr_part_number: ATE1D-6M3-10-Z; Voltage: NA; Wattage: NA; Package: THRU-HOLE; Distributor_name: DIGIKEY; Distributor_part_number: 563-1759-ND; Height: 5.60MM; Weight: NA; Temperature: -20°C+85°C; Datasheet: Y:\MIS_DATABASE\DATASHEETS\MISC\SWITCHES\ATE-SER.PDF; Crtd /date: MANIRAJA/291217; Chkd/date: MANIRAJA/291217; MECHANICAL 3D STEP FILE: SW3_ATE1F-6M3_370X710_TH_5-6
TP2 TP4 TP6 TP21 TP88 = TESTPOINT: ACCESSORIE PC TEST POINT; Mistral Part No: 160016120008-R; Mfr_name: KEYSTONE; Part_type: ACCESSORIES; Project: EPOS_EVM; Tolerance: NA; Mfr_part_number: 5002; Voltage: NA; Wattage: NA; Package: NA; Distributor_name: DIGIKEY; Distributor_part_number: 36-5002-ND; Library Ref: TESTPOINT; Height: 4.57MM; Weight: NA; Temperature: NA; Datasheet: Y:\MIS_DATABASE\DATASHEETS\MISC\ACCESSORIES\5002.PDF; Crtd /date: MANIRAJA/121216; Chkd/date: VASANTHA/121216; MECHANICAL 3D STEP FILE: TP_CIR67D40_TH_4-6; PCB Footprint: TP_CIR67D40_TH_4-6
TP9 = TESTPOINT: TESTPOINT 1.0MM DRILL PTH; Part_type: MISC\TESTPOINT; Mfr_name: LOCAL; Mistral Part No: 130009030938; Project: HSE; NI_MARK: DNI; Library Ref: TESTPOINT; PCB Footprint: TP_40X65; Chkd/date: MAZHAR/271211; Crtd /date: SHREESHAIL/041005; Datasheet: NA; Height: NA; Distributor_part_number: NA; Distributor_name: NA; Package: THRU-HOLE; Mfr_part_number: TP_40X65
TP10 = TESTPOINT: TESTPOINT 1.0MM DRILL PTH; Mistral Part No: 130009030938; Mfr_name: LOCAL; Part_type: MISC\TESTPOINT; Project: HSE; NI_MARK: DNI; Library Ref: TESTPOINT; PCB Footprint: TP_40X65; Mfr_part_number: TP_40X65; Package: THRU-HOLE; Distributor_name: NA; Distributor_part_number: NA; Height: NA; Datasheet: NA; Crtd /date: SHREESHAIL/041005; Chkd/date: MAZHAR/271211
TP87 = TESTPOINT: ACCESSORIE PC TEST POINT; Part_type: ACCESSORIES; Mfr_name: KEYSTONE; Mistral Part No: 160016120008-R; Wattage: NA; Project: EPOS_EVM; MECHANICAL 3D STEP FILE: TP_CIR67D40_TH_4-6; Chkd/date: VASANTHA/121216; Crtd /date: MANIRAJA/121216; Datasheet: Y:\MIS_DATABASE\DATASHEETS\MISC\ACCESSORIES\5002.PDF; Temperature: NA; Weight: NA; Height: 4.57MM; Library Ref: TESTPOINT; Distributor_part_number: 36-5002-ND; Distributor_name: DIGIKEY; Package: NA; Voltage: NA; Tolerance: NA; Mfr_part_number: 5002; PCB Footprint: TP_CIR67D40_TH_4-6
U62 = MIC5060YML_MLF8: IC ULTRA SMALL HIGH SIDE MOSFET DRIVER MLF8; Mistral Part No: 142017100011-R; Mfr_name: MICREL; Mfr_part_number: MIC5060YML-TR; Part_type: ICS\POWER\DRIVER; Project: TI_MAXIE_CPB; Tolerance: NA; Customs_HS_Code: 85423100; Custom_Duty: 15%; Library Ref: MIC5060YML_MLF8; Voltage: NA; Wattage: NA; Package: MLF8; Distributor_name: DIGIKEY; Distributor_part_number: 576-3669-1-ND; Height: 1.00MM; Weight: NA; Temperature: -40°C+85°C; Datasheet: Y:\MIS_DATABASE\DATASHEETS\ICS\POWER\MIC5060YML.PDF; Crtd /date: MANIRAJA/131017; Chkd/date: MANIRAJA/131017; MECHANICAL 3D STEP FILE: DFN8_25-59_120X120_1; PCB Footprint: DFN8_25-59_120X120_1
U66 = LM5060_MSOP10: IC CONTROLLER HIGH-SIDE PROTECTION VSSOP10; Part_type: ICS\POWER\MANAGEMENT; Mfr_part_number: LM5060MM/NOPB; Mfr_name: TEXAS INSTRUMENTS; Mistral Part No: 142015100007-R; Custom_Duty: 15%; Customs_HS_Code: 85423100; Wattage: NA; Project: GALILEO_EVM; Library Ref: LM5060_MSOP10; Chkd/date: VASANTHA/101015; Crtd /date: VASANTHA/101015; Datasheet: Y:\MIS_DATABASE\DATASHEETS\ICS\POWER\LM5060-TI.PDF; Temperature: -40°C+125°C; Weight: NA; Height: 1.10MM; Distributor_part_number: 296-39024-1-ND; Distributor_name: DIGIKEY; Package: VSSOP10; Voltage: NA; Tolerance: NA; PCB Footprint: MSOP10_19-68_120X120